# Altium schematic sheet suns_wifi_egse_top.SchDoc: Top
size A4; SheetNumber: 1; SheetTotal: 1
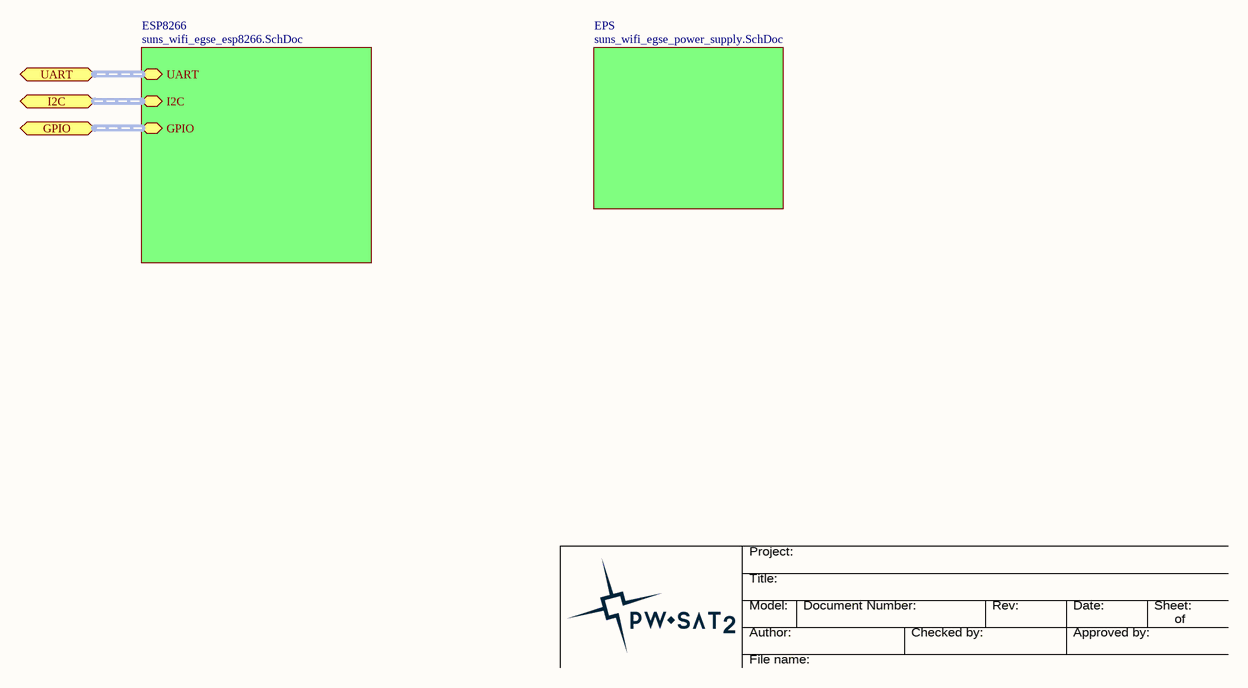
[diagram p0: suns_wifi_egse_top.SchDoc]

## Sub-sheets
EPS = suns_wifi_egse_power_supply.SchDoc: no entries
ESP8266 = suns_wifi_egse_esp8266.SchDoc: UART (harness UART), I2C (harness I2C), GPIO (harness GPIO)

## Ports
GPIO (harness GPIO), I2C (harness I2C), UART (harness UART)

## Buses and harness runs
harness port GPIO = sheet ESP8266/GPIO
harness port I2C = sheet ESP8266/I2C
harness port UART = sheet ESP8266/UART

## Notes on the sheet
- Title:
- Project:
- Author:
- Model:
- Document Number:
- Checked by:
- Rev:
- Date:
- Approved by:
- Sheet:
- of
- File name: